# EAGLE design RPi-DPI-HAT_v10 (EAGLE 7.2.0)
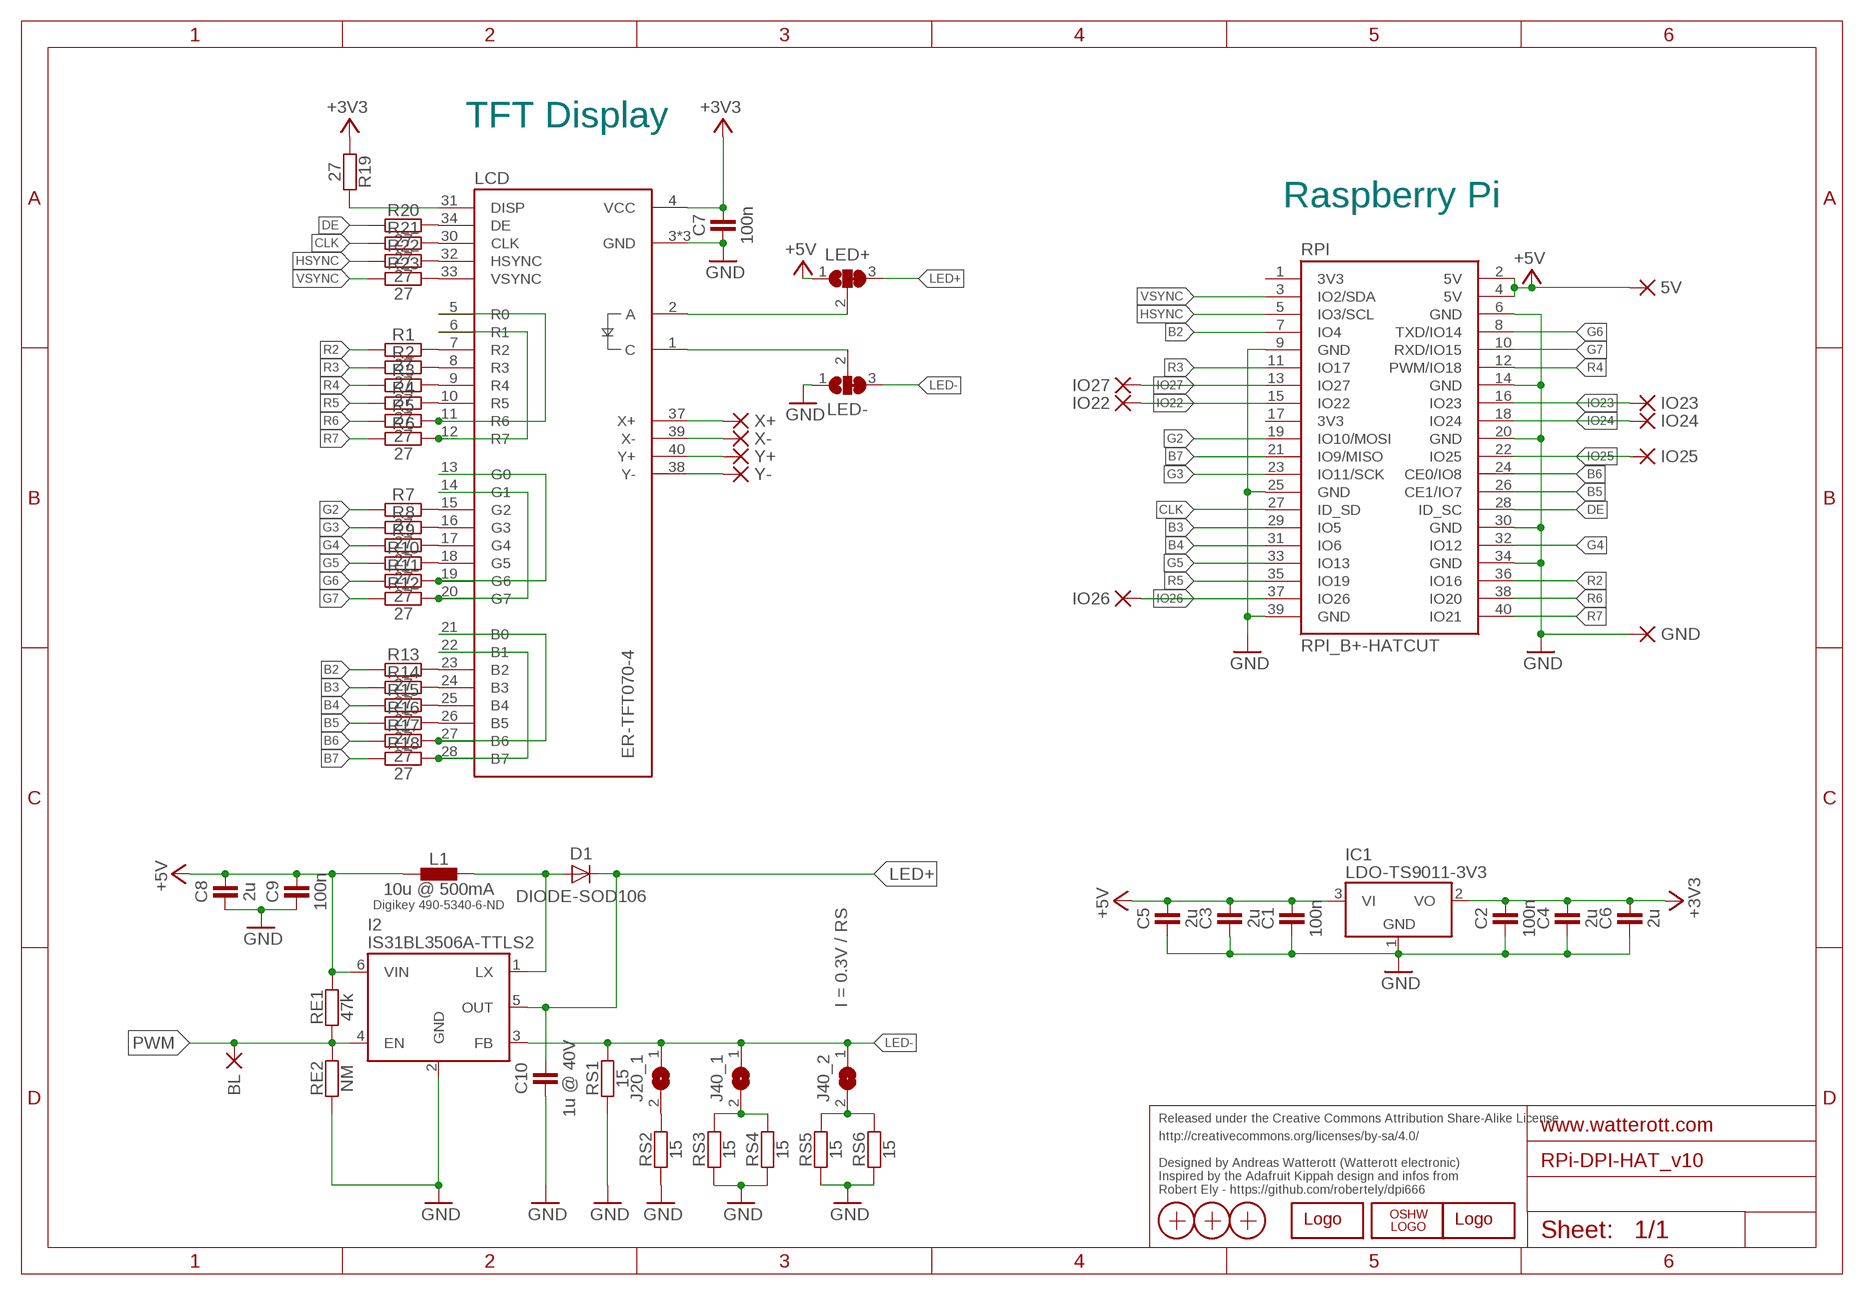
[diagram p0: schematic, sheet 1]

## Parts
5V  PAD-0.80X1.60_NC  [PAD-0.80X1.60_NC]
BL  PAD-0.80X1.60_NC  [PAD-0.80X1.60_NC]
C1  100n  CAPACITOR-0402  [C0402]
C2  100n  CAPACITOR-0402  [C0402]
C3  2u  CAPACITOR-0402  [C0402]
C4  2u  CAPACITOR-0402  [C0402]
C5  2u  CAPACITOR-0402  [C0402]
C6  2u  CAPACITOR-0402  [C0402]
C7  100n  CAPACITOR-0402  [C0402]
C8  2u  CAPACITOR-0402  [C0402]
C9  100n  CAPACITOR-0402  [C0402]
C10  1u @ 40V  CAPACITOR-0805  [C0805]
D1  DIODE-SOD106  [SOD106]
GND  PAD-0.80X1.60_NC  [PAD-0.80X1.60_NC]
I2  IS31BL3506A-TTLS2  [SOT23-6]
IC1  LDO-TS9011-3V3  [SOT23]
IO22  PAD-0.80X1.60_NC  [PAD-0.80X1.60_NC]
IO23  PAD-0.80X1.60_NC  [PAD-0.80X1.60_NC]
IO24  PAD-0.80X1.60_NC  [PAD-0.80X1.60_NC]
IO25  PAD-0.80X1.60_NC  [PAD-0.80X1.60_NC]
IO26  PAD-0.80X1.60_NC  [PAD-0.80X1.60_NC]
IO27  PAD-0.80X1.60_NC  [PAD-0.80X1.60_NC]
J20_1  JUMPER2-0402  [JUMPER2-0402]
J40_1  JUMPER2-0402  [JUMPER2-0402]
J40_2  JUMPER2-0402  [JUMPER2-0402]
L1  10u @ 500mA  INDUCTOR-1212  [L_1212]
LCD  ER-TFT070-4  [FPC40]
LED+  JUMPER3-0603-NC  [JUMPER3-0603_NC]
LED-  JUMPER3-0603-NC  [JUMPER3-0603_NC]
LOGO1  LOGO-S_PLACE_S  [SPARK_TPLACE_S]
LOGO2  OSHW_LOGOX0070  [OSHW_6X70]
LOGO3  LOGO-PLACE  [LOGO_TPLACE]
R1  27  RESISTOR-0402  [C0402]
R2  27  RESISTOR-0402  [C0402]
R3  27  RESISTOR-0402  [C0402]
R4  27  RESISTOR-0402  [C0402]
R5  27  RESISTOR-0402  [C0402]
R6  27  RESISTOR-0402  [C0402]
R7  27  RESISTOR-0402  [C0402]
R8  27  RESISTOR-0402  [C0402]
R9  27  RESISTOR-0402  [C0402]
R10  27  RESISTOR-0402  [C0402]
R11  27  RESISTOR-0402  [C0402]
R12  27  RESISTOR-0402  [C0402]
R13  27  RESISTOR-0402  [C0402]
R14  27  RESISTOR-0402  [C0402]
R15  27  RESISTOR-0402  [C0402]
R16  27  RESISTOR-0402  [C0402]
R17  27  RESISTOR-0402  [C0402]
R18  27  RESISTOR-0402  [C0402]
R19  27  RESISTOR-0402  [C0402]
R20  27  RESISTOR-0402  [C0402]
R21  27  RESISTOR-0402  [C0402]
R22  27  RESISTOR-0402  [C0402]
R23  27  RESISTOR-0402  [C0402]
RE1  47k  RESISTOR-0402  [C0402]
RE2  NM  RESISTOR-0402  [C0402]
RPI  RPI_B+-HATCUT  [RPI-B+HAT_CUTOUT]
RS1  15  RESISTOR-0402  [C0402]
RS2  15  RESISTOR-0402  [C0402]
RS3  15  RESISTOR-0402  [C0402]
RS4  15  RESISTOR-0402  [C0402]
RS5  15  RESISTOR-0402  [C0402]
RS6  15  RESISTOR-0402  [C0402]
X1  PASSER-07  [PASSER_07MM]
X2  PASSER-07  [PASSER_07MM]
X3  PASSER-07  [PASSER_07MM]
X+  PAD-0.80X1.60_NC  [PAD-0.80X1.60_NC]
X-  PAD-0.80X1.60_NC  [PAD-0.80X1.60_NC]
Y+  PAD-0.80X1.60_NC  [PAD-0.80X1.60_NC]
Y-  PAD-0.80X1.60_NC  [PAD-0.80X1.60_NC]

## Nets
+3V3: C2.2 C4.2 C6.2 C7.2 IC1.2(VO) LCD.4(VCC) R19.1
+5V: 5V.1(P) C1.2 C3.2 C5.2 C8.2 C9.2 I2.6(VIN) IC1.3(VI) L1.1 LED+.1 RE1.2 RPI.2(5V) RPI.4(5V)
A: LCD.2(A) LED+.2
B2: R13.1 RPI.7(IO4)
B3: R14.1 RPI.29(IO5)
B4: R15.1 RPI.31(IO6)
B5: R16.1 RPI.26(CE1/IO7)
B6: R17.1 RPI.24(CE0/IO8)
B7: R18.1 RPI.21(IO9/MISO)
C: LCD.1(C) LED-.2
CLK: R21.1 RPI.27(ID_SD)
DE: R20.1 RPI.28(ID_SC)
G2: R7.1 RPI.19(IO10/MOSI)
G3: R8.1 RPI.23(IO11/SCK)
G4: R9.1 RPI.32(IO12)
G5: R10.1 RPI.33(IO13)
G6: R11.1 RPI.8(TXD/IO14)
G7: R12.1 RPI.10(RXD/IO15)
GND: C1.1 C2.1 C3.1 C4.1 C5.1 C6.1 C7.1 C8.1 C9.1 C10.1 GND.1(P) I2.2(GND) IC1.1(GND) LCD.3(GND) LCD.29(GND) LCD.36(GND) LED-.1 RE2.1 RPI.6(GND) RPI.9(GND) RPI.14(GND) RPI.20(GND) RPI.25(GND) RPI.30(GND) RPI.34(GND) RPI.39(GND) RS1.1 RS2.1 RS3.1 RS4.1 RS5.1 RS6.1
HSYNC: R22.1 RPI.5(IO3/SCL)
IO22: IO22.1(P) RPI.15(IO22)
IO23: IO23.1(P) RPI.16(IO23)
IO24: IO24.1(P) RPI.18(IO24)
IO25: IO25.1(P) RPI.22(IO25)
IO26: IO26.1(P) RPI.37(IO26)
IO27: IO27.1(P) RPI.13(IO27)
LED+: C10.2 D1.C I2.5(OUT) LED+.3
LED-: I2.3(FB) J20_1.1 J40_1.1 J40_2.1 LED-.3 RS1.2
LX: D1.A I2.1(LX) L1.2
N$1: J40_1.2 RS3.2 RS4.2
N$2: J20_1.2 RS2.2
N$3: LCD.7(R2) R1.2
N$4: LCD.5(R0) LCD.11(R6) R5.2
N$7: J40_2.2 RS5.2 RS6.2
N$8: LCD.6(R1) LCD.12(R7) R6.2
N$9: LCD.8(R3) R2.2
N$10: LCD.9(R4) R3.2
N$11: LCD.10(R5) R4.2
N$12: LCD.15(G2) R7.2
N$13: LCD.16(G3) R8.2
N$14: LCD.17(G4) R9.2
N$16: LCD.18(G5) R10.2
N$17: LCD.13(G0) LCD.19(G6) R11.2
N$18: LCD.14(G1) LCD.20(G7) R12.2
N$19: LCD.23(B2) R13.2
N$20: LCD.24(B3) R14.2
N$21: LCD.25(B4) R15.2
N$25: LCD.26(B5) R16.2
N$26: LCD.21(B0) LCD.27(B6) R17.2
N$27: LCD.22(B1) LCD.28(B7) R18.2
N$32: LCD.31(DISP) R19.2
N$33: LCD.34(DE) R20.2
N$34: LCD.30(CLK) R21.2
N$35: LCD.32(HSYNC) R22.2
N$36: LCD.33(VSYNC) R23.2
PWM: BL.1(P) I2.4(EN) RE1.1 RE2.2
R2: R1.1 RPI.36(IO16)
R3: R2.1 RPI.11(IO17)
R4: R3.1 RPI.12(PWM/IO18)
R5: R4.1 RPI.35(IO19)
R6: R5.1 RPI.38(IO20)
R7: R6.1 RPI.40(IO21)
VSYNC: R23.1 RPI.3(IO2/SDA)
X+: LCD.37(X+) X+.1(P)
X-: LCD.39(X-) X-.1(P)
Y+: LCD.40(Y+) Y+.1(P)
Y-: LCD.38(Y-) Y-.1(P)
Unconnected: RPI.1(3V3) RPI.17(3V3)

## Notes on the sheet
- TFT Display
- Raspberry Pi
- Digikey 490-5340-6-ND
- I = 0.3V / RS
- Released under the Creative Commons Attribution Share-Alike License
- http://creativecommons.org/licenses/by-sa/4.0/
- Designed by Andreas Watterott (Watterott electronic)
- Inspired by the Adafruit Kippah design and infos from 
  Robert Ely - https://github.com/robertely/dpi666

## Library data of the parts
5V BL GND IO22-IO27 X+ X- Y+ Y- = we-rcl:PAD: Pads
C1-C10 = we-rcl:CAPACITOR: Capacitors ...4.7uF @ 6.3V -> 0402 ...10uF @ 16V -> 0603 ...22uF @ 25V -> 0805
D1 = we-rcl:DIODE: Diodes
I2 = we-power:IS31BL3506A: ISSI IS31BL3506A Boost Converter for LED Backlight Input: 2.7...5V Output: up to 35V 300mV Feedback Voltage; DIGIKEY: 706-1213-6-ND
IC1 = we-power:LDO: LDOs TS1117 800mA, Vin max 12V - compatible NCP1117 1A, Vin max 20V TS9011 250mA, Vin max 12V - compatible AP2210 300mA, Vin max 15V TS5204 150mA, Vin max 16V
J20_1 J40_1 J40_2 = we-rcl:JUMPER2: 2 Pin Jumpers
L1 = we-power:INDUCTOR: Power Inductors
LCD = we-opto:ER-TFT: ER Displays TFT043-3 - 4.3" 480x272 (LED 15mA @ 25.0V) TFT050-3 - 5.0" 800x480 (LED @ 40mA @ 19.2V) TFT070-4 - 7.0" 800x480 (LED @ 40mA @ 20.4V)
LED+ LED- = we-rcl:JUMPER3: 3 Pin Jumpers
LOGO1 LOGO3 = we-symbol:LOGO: Watterott electronic Logo
LOGO2 = we-symbol:OSHW_LOGO: Open-Source-Hardware Logo
R1-R23 RE1 RE2 RS1-RS6 = we-rcl:RESISTOR: Resistors all kinds in 0603 and 0402
RPI = we-board:RPI_B+: Raspberry Pi Model B+
X1-X3 = we-symbol:PASSER: Fiducial Markers

## Board
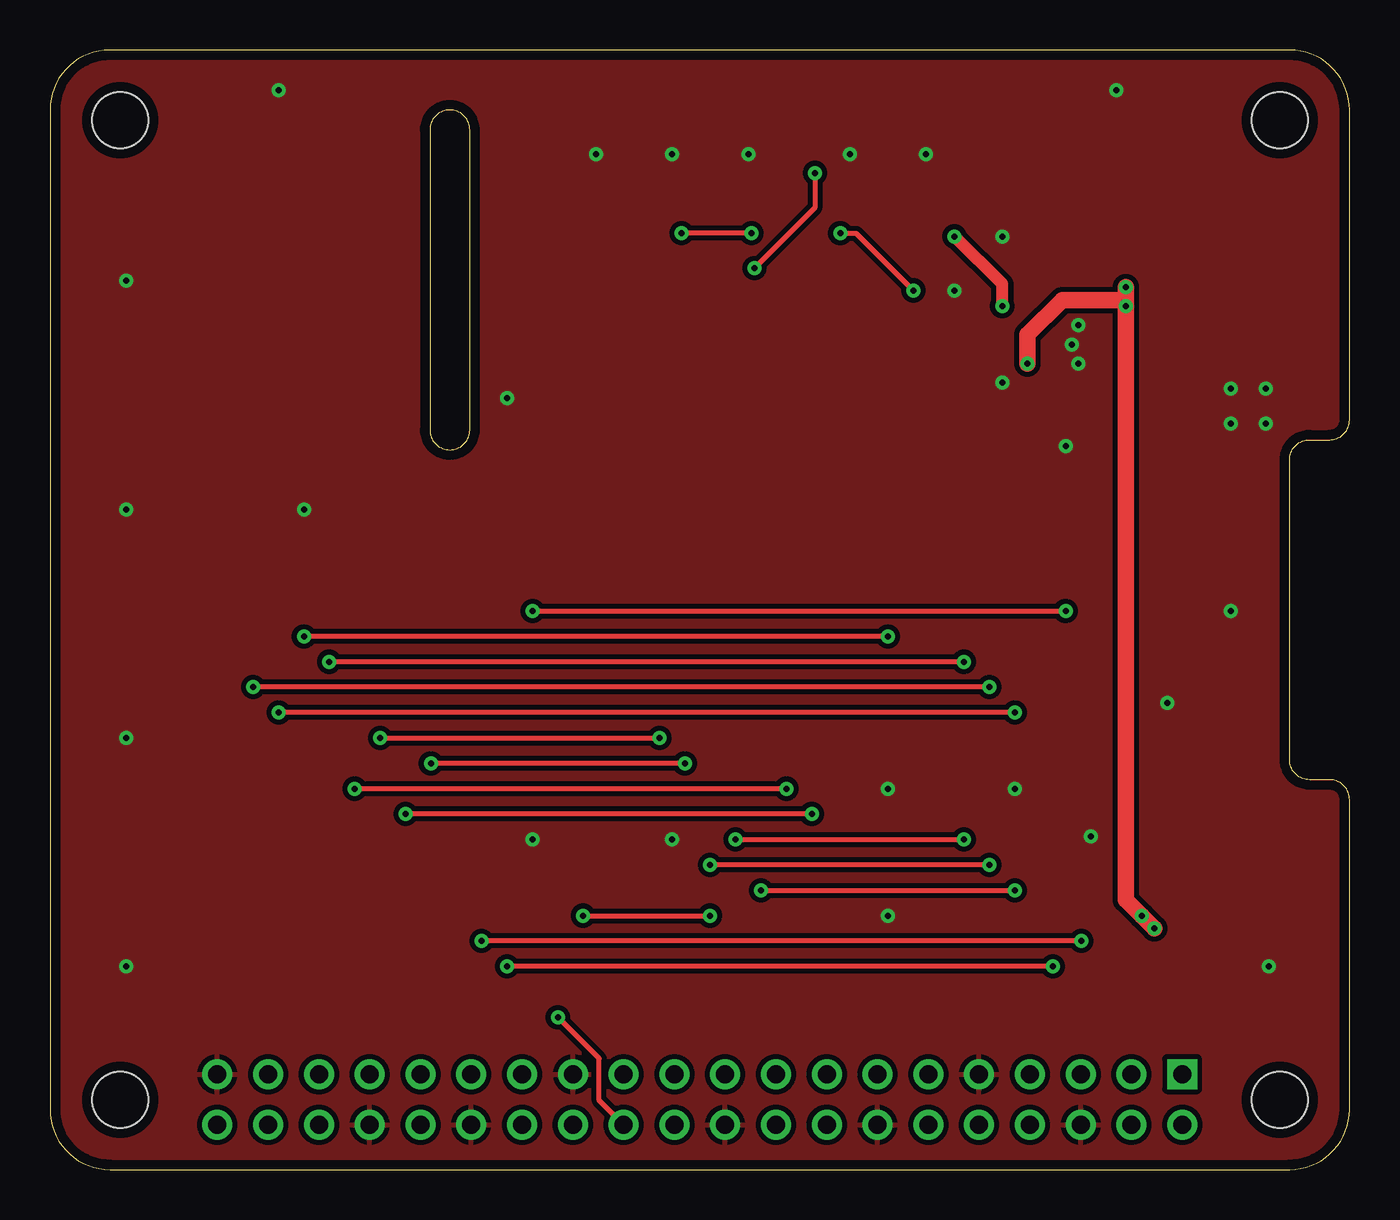
[diagram p1: board, top side]
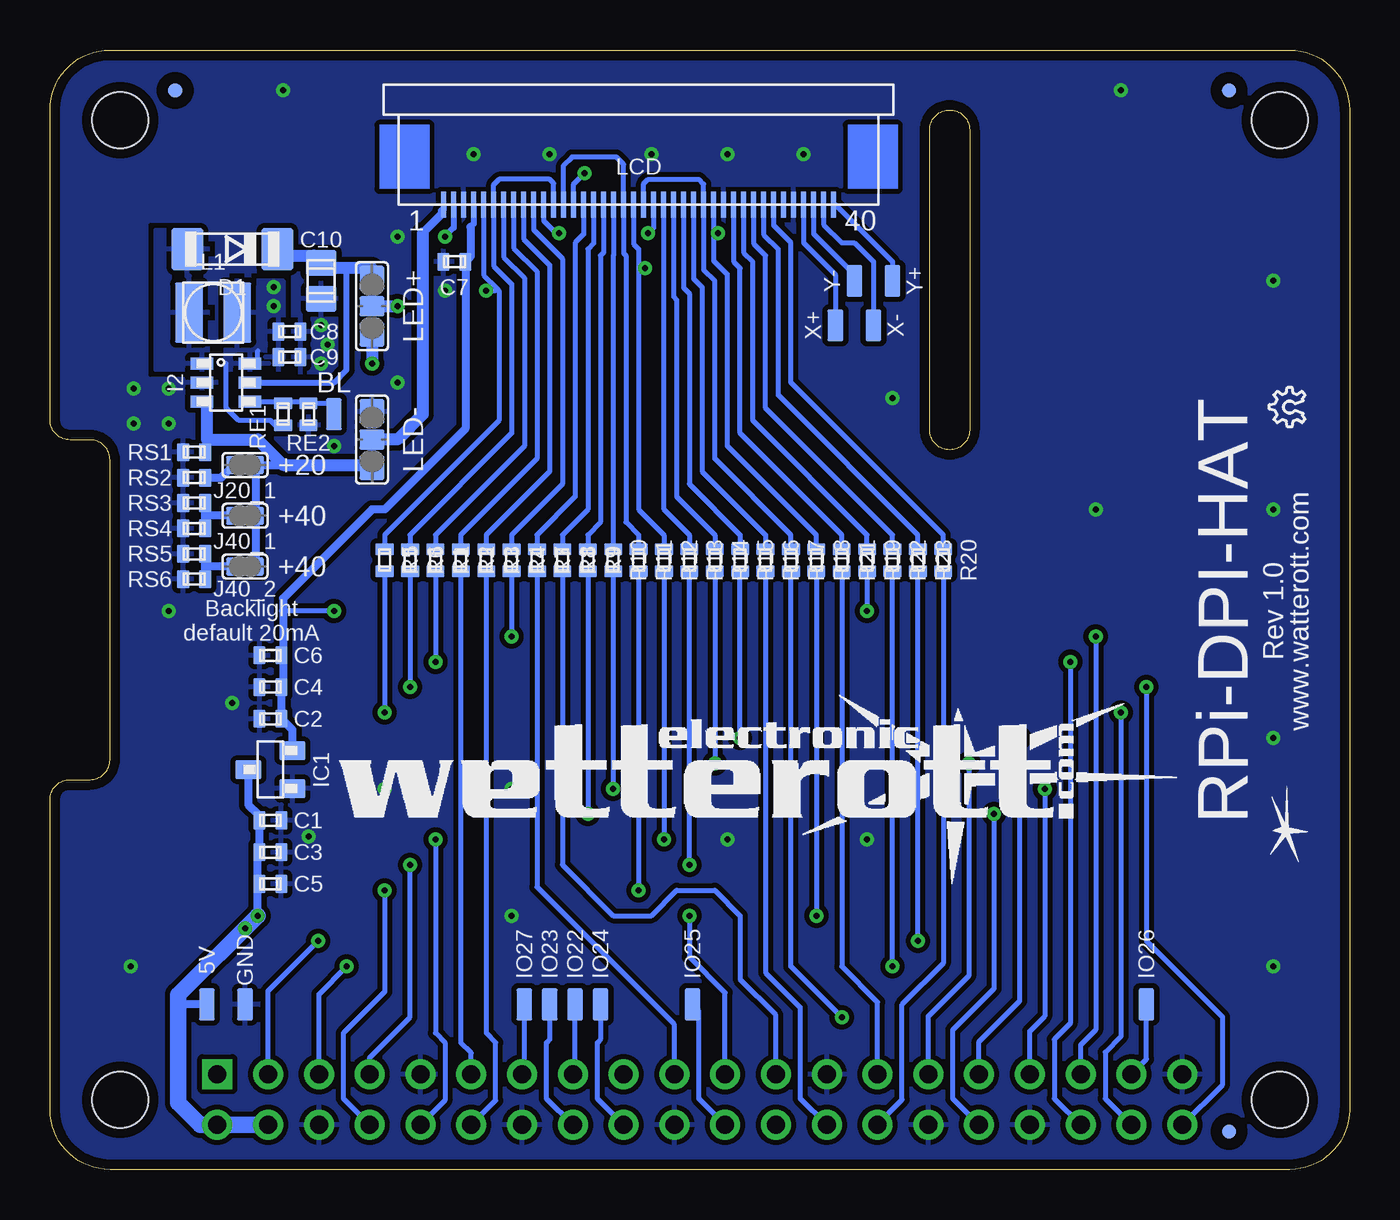
[diagram p2: board, bottom side, seen from below]

Size 65 x 56 mm. Coordinates in mm from the lower left corner, seen from the top.
Copper layers (1*16): Top 0.035mm / dielectric 1.5mm / Bottom 0.035mm
Design rules "we-dru": minimum track width 0.15mm, minimum drill 0.3mm, track to track 0.15mm, track to pad 0.15mm, pad to pad 0.15mm, via to via 0.15mm, smd to smd 0.1mm, copper to edge 0.5mm, drill to drill 0.2mm, minimum pad ring 0.18mm, minimum via ring 0.2mm, stop-mask expansion 0.1mm, vias tented up to drill 0.5mm, thermal gap 0.25mm

### Footprints (pad centres in the part's own frame; a part is rotated, then mirrored left to right if it is on the bottom)
PAD-0.80X1.60_NC = smd 0.8 x 1.6: 1 0,0
C0402 = smd 0.9 x 0.6: 1 0,0.55; 2 0,-0.55
C0805 = smd 1.55 x 1.3: 1 0,0.9; 2 0,-0.9
SOD106 = smd 2.1 x 1.6: A 0,-2.25; C 0,2.25
SOT23-6 = smd 1.2 x 0.6: 1 -1.2,0.95; 2 -1.2,0; 3 -1.2,-0.95; 4 1.2,-0.95; 5 1.2,0; 6 1.2,0.95
SOT23 = smd 1.3 x 0.9: 1 -1.1,0.95; 2 -1.1,-0.95; 3 1.1,0
JUMPER2-0402 = smd 0.9 x 0.8: 1 0,0.55; 2 0,-0.55
L_1212 = smd 3 x 1.4: 1 0,1.2; 2 0,-1.2
FPC40 = smd 1.27 x 0.279: 1 0.003,9.75; 2 0.003,9.25; 3 0.003,8.75; 4 0.003,8.25; 5 0.003,7.75; 6 0.003,7.25; 7 0.003,6.75; 8 0.003,6.25; 9 0.003,5.75; 10 0.003,5.25; 11 0.003,4.75; 12 0.003,4.25; 13 0.003,3.75; 14 0.003,3.25; 15 0.003,2.75; 16 0.003,2.25; 17 0.003,1.75; 18 0.003,1.25; 19 0.003,0.75; 20 0.003,0.25; 21 0.003,-0.25; 22 0.003,-0.75; 23 0.003,-1.25; 24 0.003,-1.75; 25 0.003,-2.25; 26 0.003,-2.75; 27 0.003,-3.25; 28 0.003,-3.75; 29 0.003,-4.25; 30 0.003,-4.75; 31 0.003,-5.25; 32 0.003,-5.75; 33 0.003,-6.25; 34 0.003,-6.75; 35 0.003,-7.25; 36 0.003,-7.75; 37 0.003,-8.25; 38 0.003,-8.75; 39 0.003,-9.25; 40 0.003,-9.75
JUMPER3-0603_NC = smd 1.25 x 1.25: 1 0,1.4; 3 0,-1.4 | smd 1.25 x 1: 2 0,0
RPI-B+HAT_CUTOUT = drill 0.9 pad 1.5 square: 1 56.63,4.77 | drill 0.9 pad 1.5: 2 56.63,2.23; 3 54.09,4.77; 4 54.09,2.23; 5 51.55,4.77; 6 51.55,2.23; 7 49.01,4.77; 8 49.01,2.23; 9 46.47,4.77; 10 46.47,2.23; 11 43.93,4.77; 12 43.93,2.23; 13 41.39,4.77; 14 41.39,2.23; 15 38.85,4.77; 16 38.85,2.23; 17 36.31,4.77; 18 36.31,2.23; 19 33.77,4.77; 20 33.77,2.23; 21 31.23,4.77; 22 31.23,2.23; 23 28.69,4.77; 24 28.69,2.23; 25 26.15,4.77; 26 26.15,2.23; 27 23.61,4.77; 28 23.61,2.23; 29 21.07,4.77; 30 21.07,2.23; 31 18.53,4.77; 32 18.53,2.23; 33 15.99,4.77; 34 15.99,2.23; 35 13.45,4.77; 36 13.45,2.23; 37 10.91,4.77; 38 10.91,2.23; 39 8.37,4.77; 40 8.37,2.23 | hole 2.8: 3.5,3.5; 3.5,52.5; 61.5,52.5; 61.5,3.5
PASSER_07MM = smd 0.7 x 0.7: X 0,0

### Placement (x,y rotation side)
5V  57.15,8.26 0 bottom
BL  50.8,37.78 180 bottom
C1  53.98,17.46 270 bottom
C2  53.98,22.54 90 bottom
C3  53.98,15.88 270 bottom
C4  53.98,24.13 90 bottom
C5  53.98,14.29 270 bottom
C6  53.98,25.72 90 bottom
C7  44.77,45.4 90 bottom
C8  53.02,41.91 270 bottom
C9  53.02,40.64 270 bottom
C10  51.44,44.45 180 bottom
D1  55.88,46.04 270 bottom
GND  55.24,8.26 0 bottom
I2  56.2,39.37 0 bottom
IC1  53.98,20 180 bottom
IO22  38.73,8.26 0 bottom
IO23  40.01,8.26 0 bottom
IO24  37.47,8.26 0 bottom
IO25  32.86,8.26 0 bottom
IO26  10.16,8.26 0 bottom
IO27  41.27,8.26 0 bottom
J20_1  55.24,35.24 270 bottom
J40_1  55.24,32.7 270 bottom
J40_2  55.24,30.16 270 bottom
L1  56.83,42.86 270 bottom
LCD  35.56,48.26 90 bottom
LED+  48.9,43.18 180 bottom
LED-  48.9,36.51 0 bottom
LOGO1  3.17,16.99 90 bottom
LOGO2  2.22,37.15 90 bottom
LOGO3  50.8,13.97 0 bottom
R1  45.72,30.48 180 bottom
R2  44.45,30.48 180 bottom
R3  43.18,30.48 180 bottom
R4  41.91,30.48 180 bottom
R5  48.26,30.48 180 bottom
R6  46.99,30.48 180 bottom
R7  40.64,30.48 180 bottom
R8  39.37,30.48 180 bottom
R9  38.1,30.48 180 bottom
R10  36.83,30.48 180 bottom
R11  35.56,30.48 180 bottom
R12  34.29,30.48 180 bottom
R13  33.02,30.48 180 bottom
R14  31.75,30.48 180 bottom
R15  30.48,30.48 180 bottom
R16  29.21,30.48 180 bottom
R17  27.94,30.48 180 bottom
R18  26.67,30.48 180 bottom
R19  24.13,30.48 180 bottom
R20  20.32,30.48 180 bottom
R21  25.4,30.48 180 bottom
R22  22.86,30.48 180 bottom
R23  21.59,30.48 180 bottom
RE1  53.34,37.78 0 bottom
RE2  52.07,37.78 180 bottom
RPI  0,0 0 top
RS1  57.78,35.88 90 bottom
RS2  57.78,34.61 90 bottom
RS3  57.78,33.34 90 bottom
RS4  57.78,32.07 90 bottom
RS5  57.78,30.8 90 bottom
RS6  57.78,29.53 90 bottom
X1  6.03,1.91 0 bottom
X2  6.03,53.98 0 bottom
X3  58.74,53.98 0 bottom
X+  25.72,42.23 0 bottom
X-  23.81,42.23 0 bottom
Y+  22.86,44.45 0 bottom
Y-  24.77,44.45 0 bottom

### Tracks (layer width: path | path; a pad name or v marks a point on that pad's centre or on a via)
+3V3  (via drill 0.3)
  Top 0.254: v24.13,27.94 v50.8,27.94
  Bottom 0.254: R19.1 v24.13,27.94 | v50.8,27.94 53.34,27.94
  Bottom 0.305: LCD.4 43.81,47.31 43.97,47.15
  Bottom 0.406: 53.34,25.72 53.34,27.94 53.34,28.57 48.9,33.02 48.26,33.02 44.22,37.06 C7.2 43.97,45.65 43.97,47.15 | IC1.2 52.88,21.99 C2.2 C4.2 53.34,24.21 53.34,25.4 53.34,25.72 | C6.2 53.34,25.72
+5V  (via drill 0.3)
  Top 0.813: v55.24,12.06 v54.61,12.7 53.82,13.49 v53.82,43.18 53.82,43.5 | v48.9,40.32 48.9,41.75 50.64,43.5 53.82,43.5 | v53.82,44.13 53.82,43.5
  Bottom 0.254: RE1.2 53.74,37.23 53.98,37.47 55.56,37.47 56.2,38.1 56.2,40.32 | 54.61,40.32 54.61,40.96
  Bottom 0.406: IC1.3 55.08,18.25 54.61,17.78 54.61,17.55 C1.2 C3.2 54.61,15.79 54.61,14.29 | v54.61,12.7 54.61,13.97 54.61,14.29 | 5V.1 58.58,8.26 | C5.2 54.61,14.29
  Bottom 0.61: LED+.1 v48.9,40.32
  Bottom 0.813: RPI.4 RPI.2 57.48,2.23 58.58,3.33 58.58,8.26 58.58,8.73 v54.61,12.7
  pour Bottom: 53.34,40.01 56.2,40.01 56.2,44.45 53.34,44.45
A  (via drill 0.3)
  Top 0.61: v47.62,43.18 47.62,44.29 v45.24,46.67
  Bottom 0.305: LCD.2 44.81,47.11 v45.24,46.67
  Bottom 0.61: LED+.2 v47.62,43.18
B2  (via drill 0.3)
  Top 0.254: v46.99,15.24 v33.02,15.24
  Bottom 0.254: v46.99,15.24 46.99,7.62 49.01,5.6 RPI.7 | v33.02,15.24 R13.1
B3  (via drill 0.3)
  Top 0.254: v31.75,20.32 v19.05,20.32
  Bottom 0.254: R14.1 v31.75,20.32 | v19.05,20.32 19.05,9.68 21.07,7.66 RPI.29
B4  (via drill 0.3)
  Top 0.254: v16.51,21.59 v30.48,21.59
  Bottom 0.254: v30.48,21.59 R15.1 | v16.51,21.59 16.51,8.41 18.53,6.39 RPI.31
B5
  Bottom 0.254: R16.1 29.21,9.84 27.46,8.1 27.46,3.54 RPI.26
B6  (via drill 0.3)
  Top 0.254: RPI.24 27.46,3.46 27.46,5.56 v25.4,7.62
  Bottom 0.254: v25.4,7.62 27.94,10.16 R17.1
B7  (via drill 0.3)
  Top 0.254: v26.67,12.7 v33.02,12.7
  Bottom 0.254: R18.1 v26.67,12.7 | v33.02,12.7 33.02,10.64 31.23,8.85 RPI.21
C
  Bottom 0.305: LCD.1 45.31,48.03 45.4,47.94
  Bottom 0.406: 45.4,47.94 45.4,47.78 46.35,46.83
  Bottom 0.61: 46.35,46.83 46.35,37.78 47.62,36.51 LED-.2
CLK
  Bottom 0.254: R21.1 25.4,10.16 23.61,8.37 RPI.27
DE
  Bottom 0.254: R20.1 20.32,10.32 22.38,8.26 22.38,3.49 23.61,2.27 RPI.28
G2
  Bottom 0.254: R7.1 40.64,14.13 33.77,7.26 RPI.19
G3
  Bottom 0.254: R8.1 39.37,15.24 36.83,12.7 34.92,12.7 33.66,13.97 31.75,13.97 30.48,12.7 30.48,9.53 28.69,7.74 RPI.23
G4  (via drill 0.3)
  Top 0.254: v38.1,17.78 v17.78,17.78
  Bottom 0.254: R9.1 v38.1,17.78 | v17.78,17.78 17.78,9.05 19.84,6.99 19.84,3.54 RPI.32
G5  (via drill 0.3)
  Top 0.254: v36.83,19.05 v15.24,19.05
  Bottom 0.254: R10.1 v36.83,19.05 | v15.24,19.05 15.24,7.67 15.99,6.92 RPI.33
G6  (via drill 0.3)
  Top 0.254: v35.56,13.97 v48.26,13.97
  Bottom 0.254: R11.1 v35.56,13.97 | v48.26,13.97 48.26,8.89 50.32,6.83 50.32,3.54 RPI.8
G7  (via drill 0.3)
  Top 0.254: v34.29,16.51 v45.72,16.51
  Bottom 0.254: R12.1 v34.29,16.51 | v45.72,16.51 45.72,6.83 45.24,6.35 45.24,3.46 RPI.10
GND  (via drill 0.3)
  other vias: 51.44,42.23 51.44,40.32 59.05,39.05 47.62,39.37 43.81,50.8 27.3,50.8 59.05,37.31 52.07,16.67 55.88,23.34 22.86,38.58 53.34,53.98 11.43,53.98 59.05,27.94 50.8,36.2 45.24,43.97 31.11,50.8 34.92,50.8 40.01,50.8 3.81,10.16 3.81,21.59 3.81,33.02 3.81,44.45 48.26,19.05 60.96,10.16 31.11,16.51 24.13,16.51 41.91,19.05 41.91,12.7 12.7,33.02 60.8,39.05 60.8,37.31 47.62,46.67 51.12,41.27
  pour Top (isolate 0.254): 0,0 65,0 65,56 0,56
  pour Bottom (isolate 0.254, rank 2): 0,0 65,0 65,56 0,56
HSYNC  (via drill 0.3)
  Top 0.254: v50.16,10.16 v22.86,10.16
  Bottom 0.254: v22.86,10.16 R22.1 | RPI.5 51.55,8.78 v50.16,10.16
IO22
  Bottom 0.254: RPI.15 arc-90 38.73,4.88 IO22.1
IO23
  Bottom 0.254: RPI.16 40.16,3.54 40.16,6.35 40.01,6.51 IO23.1
IO24
  Bottom 0.254: RPI.18 37.62,3.54 37.62,6.35 37.47,6.51 IO24.1
IO25
  Bottom 0.254: RPI.22 32.54,3.54 32.54,7.94 IO25.1
IO26
  Bottom 0.254: RPI.37 10.16,5.52 IO26.1
IO27
  Bottom 0.254: RPI.13 41.27,4.88 IO27.1
LED+
  Bottom 0.305: I2.5 50.8,39.37 50.16,40.01 50.16,45.09
  Bottom 0.61: LED+.3 48.9,45.09 50.16,45.09 51.17,45.09 C10.2 51.8,45.72 53.34,45.72 53.63,46.01 D1.C
LED-
  Bottom 0.254: 49.02,35.24 LED-.3 | I2.3 57.15,38.42
  Bottom 0.406: 53.34,35.24 J20_1.1 J40_1.1 J40_2.1 | 57.15,36.51 57.15,35.96 RS1.2
  Bottom 0.61: 49.02,35.24 53.34,35.24 54.61,36.51 57.15,36.51 57.15,38.42
LX
  pour Bottom: 57.15,40.01 59.69,40.01 59.69,46.99 57.15,46.99
N$1
  Bottom 0.406: RS4.2 57.23,32.7 | 57.23,32.7 RS3.2 | J40_1.2 57.23,32.7
N$2
  Bottom 0.406: RS2.2 56.43,34.61 J20_1.2
N$3
  Bottom 0.254: LCD.7 42.31,45.64 41.27,44.61 41.27,36.2 45.72,31.75 R1.2
N$4  (via drill 0.3)
  Top 0.254: v39.53,46.83 40.32,46.83 v43.18,43.97
  Bottom 0.254: LCD.5 43.31,44.74 42.62,44.05 | 42.62,44.05 42.55,43.97 42.55,37.47 48.26,31.75 R5.2 | LCD.11 40.31,47.45 39.69,46.83 v39.53,46.83 | v43.18,43.97 42.7,43.97 42.62,44.05
N$5
  Bottom 0.406: 48.9,44.45 48.9,43.34
N$6
  Bottom 0.406: 48.9,35.08 48.9,36.35
N$7
  Bottom 0.406: RS6.2 57.23,30.16 | 57.23,30.16 RS5.2 | J40_2.2 57.23,30.16
N$8
  Bottom 0.254: R6.2 46.99,31.75 41.91,36.83 41.91,44.29 42.81,45.19 LCD.6 42.81,49.27 42.55,49.53 40.01,49.53 39.81,49.34 LCD.12
N$9
  Bottom 0.254: LCD.8 41.81,46.1 40.64,44.93 40.64,35.56 44.45,31.75 R2.2
N$10
  Bottom 0.254: LCD.9 41.31,46.55 40.01,45.24 40.01,34.92 43.18,31.75 R3.2
N$11
  Bottom 0.254: LCD.10 40.81,47 39.37,45.56 39.37,34.29 41.91,31.75 R4.2
N$12
  Bottom 0.254: LCD.15 38.31,46.78 38.73,46.35 38.73,33.66 40.64,31.75 R7.2
N$13
  Bottom 0.254: LCD.16 37.81,46.33 38.1,46.04 38.1,33.02 39.37,31.75 R8.2
N$14
  Bottom 0.254: LCD.17 37.31,45.88 37.47,45.72 37.47,32.38 38.1,31.75 R9.2
N$16
  Bottom 0.254: LCD.18 36.81,45.74 36.83,45.72 R10.2
N$17
  Bottom 0.254: R11.2 35.56,31.75 36.2,32.38 36.2,45.72 36.31,45.84 LCD.19 36.31,50.28 36.67,50.64 38.89,50.64 39.31,50.23 LCD.13
N$18  (via drill 0.3)
  Top 0.254: v38.26,49.85 38.26,48.1 v35.24,45.09
  Bottom 0.254: LCD.20 35.81,46.29 35.56,46.04 35.56,45.09 | 35.56,45.09 35.56,33.02 34.29,31.75 R12.2 | LCD.14 38.81,49.3 v38.26,49.85 | v35.24,45.09 35.56,45.09
N$19
  Bottom 0.254: LCD.23 34.31,33.04 33.02,31.75 R13.2
N$20
  Bottom 0.254: LCD.24 33.81,43.65 33.66,43.5 33.66,33.66 31.75,31.75 R14.2
N$21
  Bottom 0.254: LCD.25 33.31,44.1 33.02,43.81 33.02,34.29 30.48,31.75 R15.2
N$25
  Bottom 0.254: LCD.26 32.81,44.56 32.38,44.13 32.38,34.92 29.21,31.75 R16.2
N$26
  Bottom 0.254: R17.2 27.94,31.75 31.75,35.56 31.75,44.45 32.31,45.01 LCD.27 32.31,49.3 32.54,49.53 35.08,49.53 35.31,49.3 LCD.21
N$27  (via drill 0.3)
  Top 0.254: v35.08,46.83 v31.59,46.83
  Bottom 0.254: R18.2 26.67,31.75 31.11,36.2 31.11,44.77 31.81,45.46 31.81,46.83 | LCD.28 31.81,46.83 | LCD.22 34.81,47.1 v35.08,46.83 | v31.59,46.83 31.81,46.83
N$32
  Bottom 0.254: R19.2 24.13,31.75 29.84,37.47 29.84,45.4 30.31,45.87 LCD.31
N$33
  Bottom 0.254: R20.2 20.32,31.75 27.94,39.37 27.94,46.35 28.81,47.23 LCD.34
N$34
  Bottom 0.254: R21.2 25.4,31.75 30.48,36.83 30.48,45.09 30.81,45.41 LCD.30
N$35
  Bottom 0.254: R22.2 22.86,31.75 29.21,38.1 29.21,45.72 29.81,46.32 LCD.32
N$36
  Bottom 0.254: R23.2 21.59,31.75 28.57,38.73 28.57,46.04 29.31,46.77 LCD.33
PWM
  Bottom 0.254: I2.4 53.43,38.42 RE1.1 53.34,38.42 52.16,38.42 RE2.2 51.03,38.33 50.8,38.1 BL.1
R2  (via drill 0.3)
  Top 0.254: v45.72,25.4 v13.97,25.4
  Bottom 0.254: R1.1 v45.72,25.4 | v13.97,25.4 13.97,7.3 14.76,6.51 14.76,3.54 RPI.36
R3
  Bottom 0.254: R2.1 44.45,6.35 43.93,5.83 RPI.11
R4
  Bottom 0.254: R3.1 43.18,6.83 42.7,6.35 42.7,3.46 RPI.12
R5  (via drill 0.3)
  Top 0.254: v41.91,26.67 v12.7,26.67
  Bottom 0.254: R4.1 v41.91,26.67 | v12.7,26.67 12.7,6.99 13.45,6.24 RPI.35
R6  (via drill 0.3)
  Top 0.254: v48.26,22.86 v11.43,22.86
  Bottom 0.254: R5.1 v48.26,22.86 | v11.43,22.86 11.43,6.67 12.22,5.87 12.22,3.54 RPI.38
R7  (via drill 0.3)
  Top 0.254: v46.99,24.13 v10.16,24.13
  Bottom 0.254: R6.1 v46.99,24.13 | v10.16,24.13 10.16,11.43 6.35,7.62 6.35,4.25 RPI.40
VSYNC  (via drill 0.3)
  Top 0.254: v51.59,11.43 v21.59,11.43
  Bottom 0.254: v21.59,11.43 R23.1 | RPI.3 54.09,8.93 v51.59,11.43
X+
  Bottom 0.254: LCD.37 27.31,46.36 25.72,44.77 X+.1
X-
  Bottom 0.254: LCD.39 26.31,47.27 25.4,46.35 24.77,46.35 23.81,45.4 X-.1
Y+
  Bottom 0.254: LCD.40 25.72,48.26 22.86,45.4 Y+.1
Y-
  Bottom 0.254: LCD.38 26.81,46.81 24.77,44.77 Y-.1

### Text on the board
bPlace: 40 | 1 | +20 | +40 | +40 | www.watterott.com | Rev 1.0 | RPi-DPI-HAT | Backlight / default 20mA
Reference: Silkscreen: 22 bPlace